# Altium schematic sheet Sheet1.SchDoc
size A4; SheetNumber: 1; SheetTotal: 1
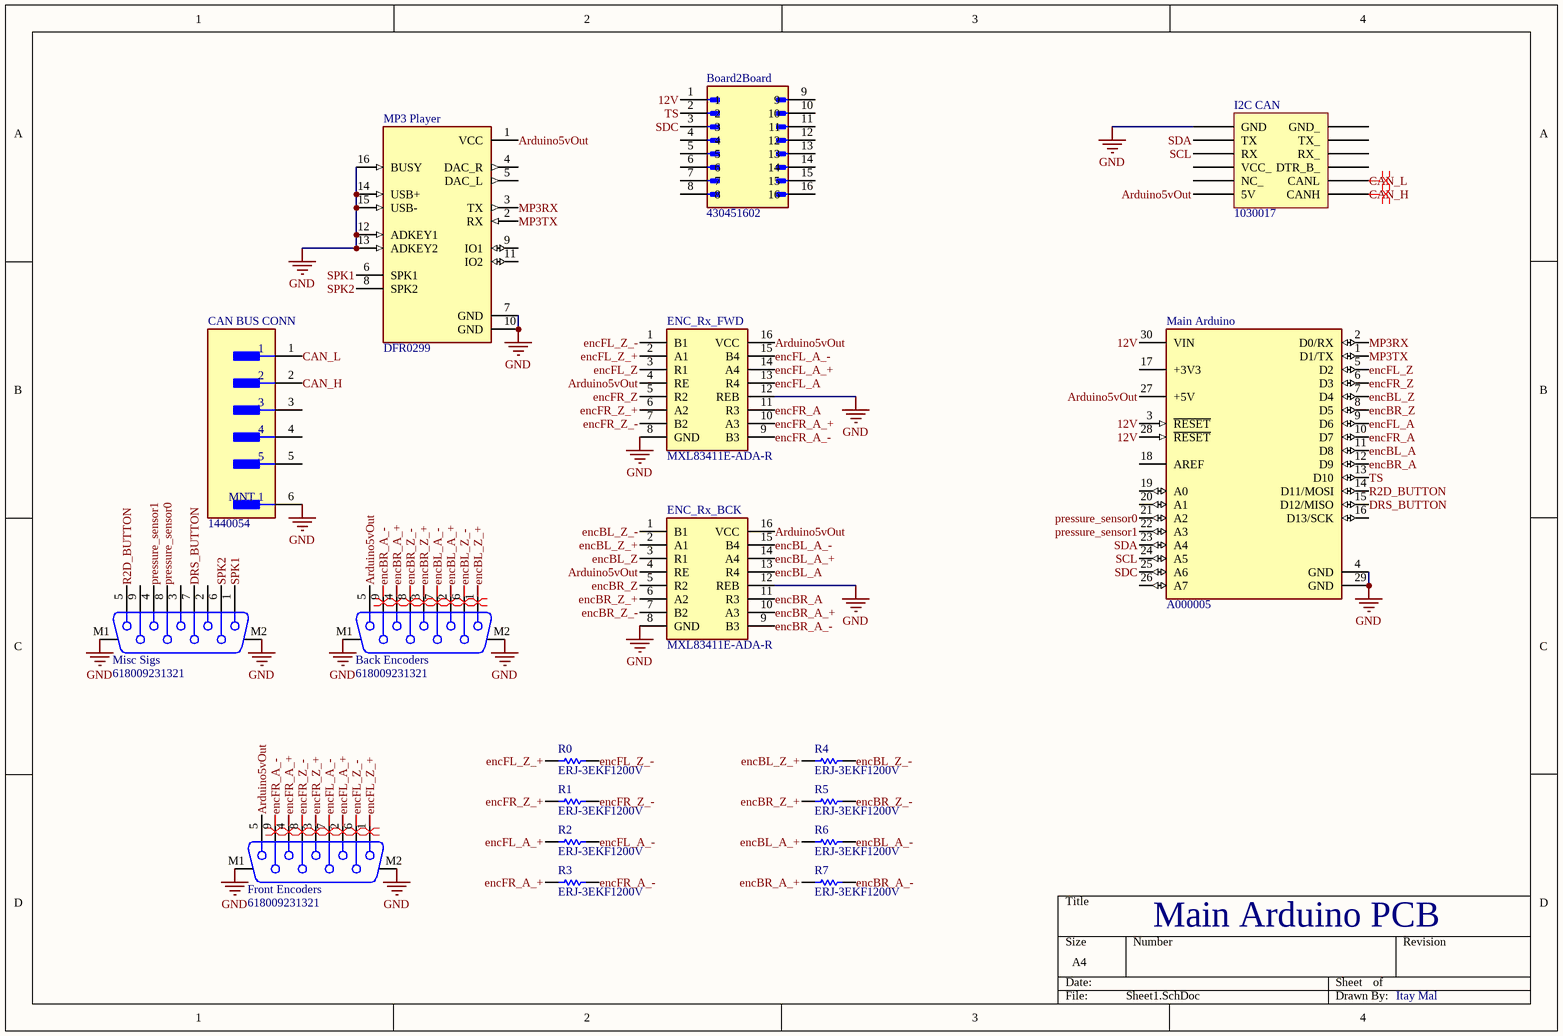
[diagram p0: Sheet1.SchDoc]

## Parts
Back_Encoders  618009231321  [618009231321]
Board2Board  430451602  [MOLEX_430451602]
CAN_BUS_CONN  1440054  [FP-1440054-MFG]
ENC_Rx_BCK  MXL83411E-ADA-R  [SOIC127P600X175-16N]
ENC_Rx_FWD  MXL83411E-ADA-R  [SOIC127P600X175-16N]
Front_Encoders  618009231321  [618009231321]
I2C_CAN  I2C_CAN  [I2C_CAN-Footprint-1]  (value not drawn)
Main_Arduino  A000005  [FP-A000005-MFG]
Misc_Sigs  618009231321  [618009231321]
MP3_Player  DFR0299  [MODULE_DFR0299]
R0  ERJ-3EKF1200V  [RESC1609X55X30ML15T15]
R1  ERJ-3EKF1200V  [RESC1609X55X30ML15T15]
R2  ERJ-3EKF1200V  [RESC1609X55X30ML15T15]
R3  ERJ-3EKF1200V  [RESC1609X55X30ML15T15]
R4  ERJ-3EKF1200V  [RESC1609X55X30ML15T15]
R5  ERJ-3EKF1200V  [RESC1609X55X30ML15T15]
R6  ERJ-3EKF1200V  [RESC1609X55X30ML15T15]
R7  ERJ-3EKF1200V  [RESC1609X55X30ML15T15]

## Nets
GND: Back_Encoders.M1 Back_Encoders.M2 CAN_BUS_CONN.6(MNT_1) ENC_Rx_BCK.8(GND) ENC_Rx_BCK.12(REB) ENC_Rx_FWD.8(GND) ENC_Rx_FWD.12(REB) Front_Encoders.M1 Front_Encoders.M2 I2C_CAN.GND Main_Arduino.4(GND) Main_Arduino.29(GND) Misc_Sigs.M1 Misc_Sigs.M2 MP3_Player.7(GND) MP3_Player.10(GND) MP3_Player.12(ADKEY1) MP3_Player.13(ADKEY2) MP3_Player.14(USB+) MP3_Player.15(USB-) MP3_Player.16(BUSY)
12V: Board2Board.1 Main_Arduino.3(~{RESET}) Main_Arduino.28(~{RESET}) Main_Arduino.30(VIN)
Arduino5vOut: Back_Encoders.5 ENC_Rx_BCK.4(RE) ENC_Rx_BCK.16(VCC) ENC_Rx_FWD.4(RE) ENC_Rx_FWD.16(VCC) Front_Encoders.5 I2C_CAN.5V Main_Arduino.27(+5V) MP3_Player.1(VCC)
CAN_H: CAN_BUS_CONN.2 I2C_CAN.CANH
CAN_L: CAN_BUS_CONN.1 I2C_CAN.CANL
DRS_BUTTON: Main_Arduino.15(D12/MISO) Misc_Sigs.7
encBL_A: ENC_Rx_BCK.13(R4) Main_Arduino.11(D8)
encBL_A_+: Back_Encoders.2 ENC_Rx_BCK.14(A4) R6.1
encBL_A_-: Back_Encoders.7 ENC_Rx_BCK.15(B4) R6.2
encBL_Z: ENC_Rx_BCK.3(R1) Main_Arduino.7(D4)
encBL_Z_+: Back_Encoders.1 ENC_Rx_BCK.2(A1) R4.1
encBL_Z_-: Back_Encoders.6 ENC_Rx_BCK.1(B1) R4.2
encBR_A: ENC_Rx_BCK.11(R3) Main_Arduino.12(D9)
encBR_A_+: Back_Encoders.4 ENC_Rx_BCK.10(A3) R7.1
encBR_A_-: Back_Encoders.9 ENC_Rx_BCK.9(B3) R7.2
encBR_Z: ENC_Rx_BCK.5(R2) Main_Arduino.8(D5)
encBR_Z_+: Back_Encoders.3 ENC_Rx_BCK.6(A2) R5.1
encBR_Z_-: Back_Encoders.8 ENC_Rx_BCK.7(B2) R5.2
encFL_A: ENC_Rx_FWD.13(R4) Main_Arduino.9(D6)
encFL_A_+: ENC_Rx_FWD.14(A4) Front_Encoders.2 R2.1
encFL_A_-: ENC_Rx_FWD.15(B4) Front_Encoders.7 R2.2
encFL_Z: ENC_Rx_FWD.3(R1) Main_Arduino.5(D2)
encFL_Z_+: ENC_Rx_FWD.2(A1) Front_Encoders.1 R0.1
encFL_Z_-: ENC_Rx_FWD.1(B1) Front_Encoders.6 R0.2
encFR_A: ENC_Rx_FWD.11(R3) Main_Arduino.10(D7)
encFR_A_+: ENC_Rx_FWD.10(A3) Front_Encoders.4 R3.1
encFR_A_-: ENC_Rx_FWD.9(B3) Front_Encoders.9 R3.2
encFR_Z: ENC_Rx_FWD.5(R2) Main_Arduino.6(D3)
encFR_Z_+: ENC_Rx_FWD.6(A2) Front_Encoders.3 R1.1
encFR_Z_-: ENC_Rx_FWD.7(B2) Front_Encoders.8 R1.2
MP3RX: Main_Arduino.2(D0/RX) MP3_Player.3(TX)
MP3TX: Main_Arduino.1(D1/TX) MP3_Player.2(RX)
pressure_sensor0: Main_Arduino.21(A2) Misc_Sigs.8
pressure_sensor1: Main_Arduino.22(A3) Misc_Sigs.4
R2D_BUTTON: Main_Arduino.14(D11/MOSI) Misc_Sigs.5
SCL: I2C_CAN.RX Main_Arduino.24(A5)
SDA: I2C_CAN.TX Main_Arduino.23(A4)
SDC: Board2Board.3 Main_Arduino.25(A6)
SPK1: Misc_Sigs.1 MP3_Player.6(SPK1)
SPK2: Misc_Sigs.6 MP3_Player.8(SPK2)
TS: Board2Board.2 Main_Arduino.13(D10)

Not connected (* = marked no-connect by the designer): Board2Board 4 5 6 7 8 9 10 11 12 13 14 15 16; CAN_BUS_CONN 3 4 5; I2C_CAN DTR_B_ GND_ NC_ RX_ TX_ VCC_; Main_Arduino 16(D13/SCK) 17(+3V3) 18(AREF) 19(A0) 20(A1) 26(A7); Misc_Sigs 2 3 9; MP3_Player 4(DAC_R) 5(DAC_L) 9(IO1) 11(IO2)

## Layout directives
differential pair: CAN_H, CAN_L, encBL_A_+, encBL_A_-, encBL_Z_+, encBL_Z_-, encBR_A_+, encBR_A_-, encBR_Z_+, encBR_Z_-, encFL_A_+, encFL_A_-, encFL_Z_+, encFL_Z_-, encFR_A_+, encFR_A_-, encFR_Z_+, encFR_Z_-

## Notes on the sheet
- Main Arduino PCB
- Itay Mal
- (in symbol CMP-007-000000-3) I2C CAN; 1030017

## Library data of the parts
Back_Encoders Front_Encoders Misc_Sigs = CMP-000000-1: D Type Connector, 9 Contact(s), Female, 0.109 inch Pitch, Solder Terminal, Locking, Plug; Manufacturer Series: 6180; Body Breadth: 0.492inch; Dielectric Withstanding Voltage (AC): 1kV; Contact Pattern: STAGGERED; Number of Contacts: 9; Body Depth: 0.581inch; Contact Resistance: 30mR; Number Of PCB Rows: 2; Mating Contact Row Spacing: 0.112inch; Reference Standard: UL; Rated Current (Signal): 3A; PCB Contact Row Spacing: 2.8448mm; Body Length: 1.213inch; Contact Style: RND PIN-SKT; Reliability: COMMERCIAL; Insulation Resistance: 5GR; Body/Shell Style: PLUG; Shell Finish: Nickel; Mating Contact Pitch: 0.109inch; Max Operating Temperature: 85°C; Mounting Option 1: LOCKING; Terminal Length: 0.125inch; Contact Gender: Female; Insulation Material: Polybutylene; PCB Contact Pattern: STAGGERED; Shell Material: Steel; Contact Material: Copper Alloy; RoHS Compliant: Yes; Insulation Color: Black; Mounting Technology: Board; Min Operating Temperature: -40°C; Termination: Solder; Contact Finish - Mating: AU; Reach SVHC Compliant: Yes; Number of Rows Loaded: 2; Mounting Style: RIGHT ANGLE; Terminal Pitch: 2.7686mm
Board2Board = CMP-005-000000-2: Source: 430451602.SchLib; MP: 430451602; Component Type: Standard; Availability: Unavailable; Price: None; Value: *; Pin Count: 16; Design Item ID: 430451602; Package: None
CAN_BUS_CONN = CMP-00002-1: Circular Connector; RoHS Compliant: Yes; Connector Type: Circular; Reach SVHC Compliant: No; Contact Finish - Mating: NOT SPECIFIED
ENC_Rx_BCK ENC_Rx_FWD = MXL83411E-ADA-R: Integrated Circuit; Manufacturer_Name: MaxLinear; Datasheet Link: https://assets.maxlinear.com/web/documents/mxl83411.pdf; Height: 1.75mm; Manufacturer_Part_Number: MXL83411E-ADA-R; Mouser Part Number: 701-MXL83411E-ADA-R; Mouser Price/Stock: https://www.mouser.co.uk/ProductDetail/MaxLinear/MXL83411E-ADA-R?qs=Z%252BL2brAPG1KMxbLdzofcfg%3D%3D
I2C_CAN = CMP-007-000000-3: Design Item ID: I2C_CAN; Pin Count: 12; Source: Schlib1.SchLib; Component Type: Standard
Main_Arduino = CMP-189986-000002-1: ARDUINO NANO ATMEGA328 EVAL BRD; Number of Bits: 8; Evaluation Kit: Yes; Operating Supply Voltage: 12V; Interface: I2C; Data Bus Width: 8b; Core Architecture: AVR; Packaging: Bulk; Length: 7inch; Package Quantity: 50; Width: 5inch; REACH SVHC: No SVHC; Weight: 0.358383oz; Series: AVR® ATmega; Height: 0.25inch
MP3_Player = CMP-003-000000-2: Dfplayer - a Mini Mp3 Player; Pin Count: 16; Source: DFR0299.SchLib; Package: None; Component Type: Standard; MP: DFR0299; Design Item ID: DFR0299; Price: None; Value: *; Availability: Unavailable
R0-R7 = CMP-2000-00213-2: Chip Resistor, 120 Ohm, +/- 1%, 0.1 W, -55 to 155 degC, 0603 (1608 Metric), RoHS, Tape and Reel; Manufacturer: Panasonic; Power Rating: 100mW; Voltage Rating (DC): 75V; Resistance: 120Ohm; Temperature Coefficient: 100ppm/degreesC; Number of Terminations: 2; Military Standard: Not; Tolerance: 1%; Min Operating Temperature: -55degC; Packaging: TapeandReel; Lead Free: LeadFree; Max Operating Temperature: 155degC; Manufacturer URL: http://www.panasonic.com/; Case Code (Imperial): 0603; REACH SVHC: NoSVHC; Width: 0.031inch; Datasheet URL: https://industrial.panasonic.com/cdbs/www-data/pdf/RDA0000/AOA0000C283.pdf; RoHSCompliant: true; Max Power Dissipation: 100mW; Termination: SMD/SMT; Package Reference: 0603; Height: 0.022inch; Depth: 0.8mm; Package Description: 2-Pin Surface Mount Device, Body 1.6 x 0.85 mm; Contact Plating: Tin; Length: 1.6mm; Package URL: http://www.st.com/st-web-ui/static/active/en/resource/technical/document/datasheet/CD00001320.pdf; Radiation Hardening: No; Package Quantity: 1; Number of Pins: 2; Datasheet Version: 42095.0; Voltage Rating: 75V; Composition: ThickFilm; Case/Package: 0603; Mount: SurfaceMount; Case Code (Metric): 1608